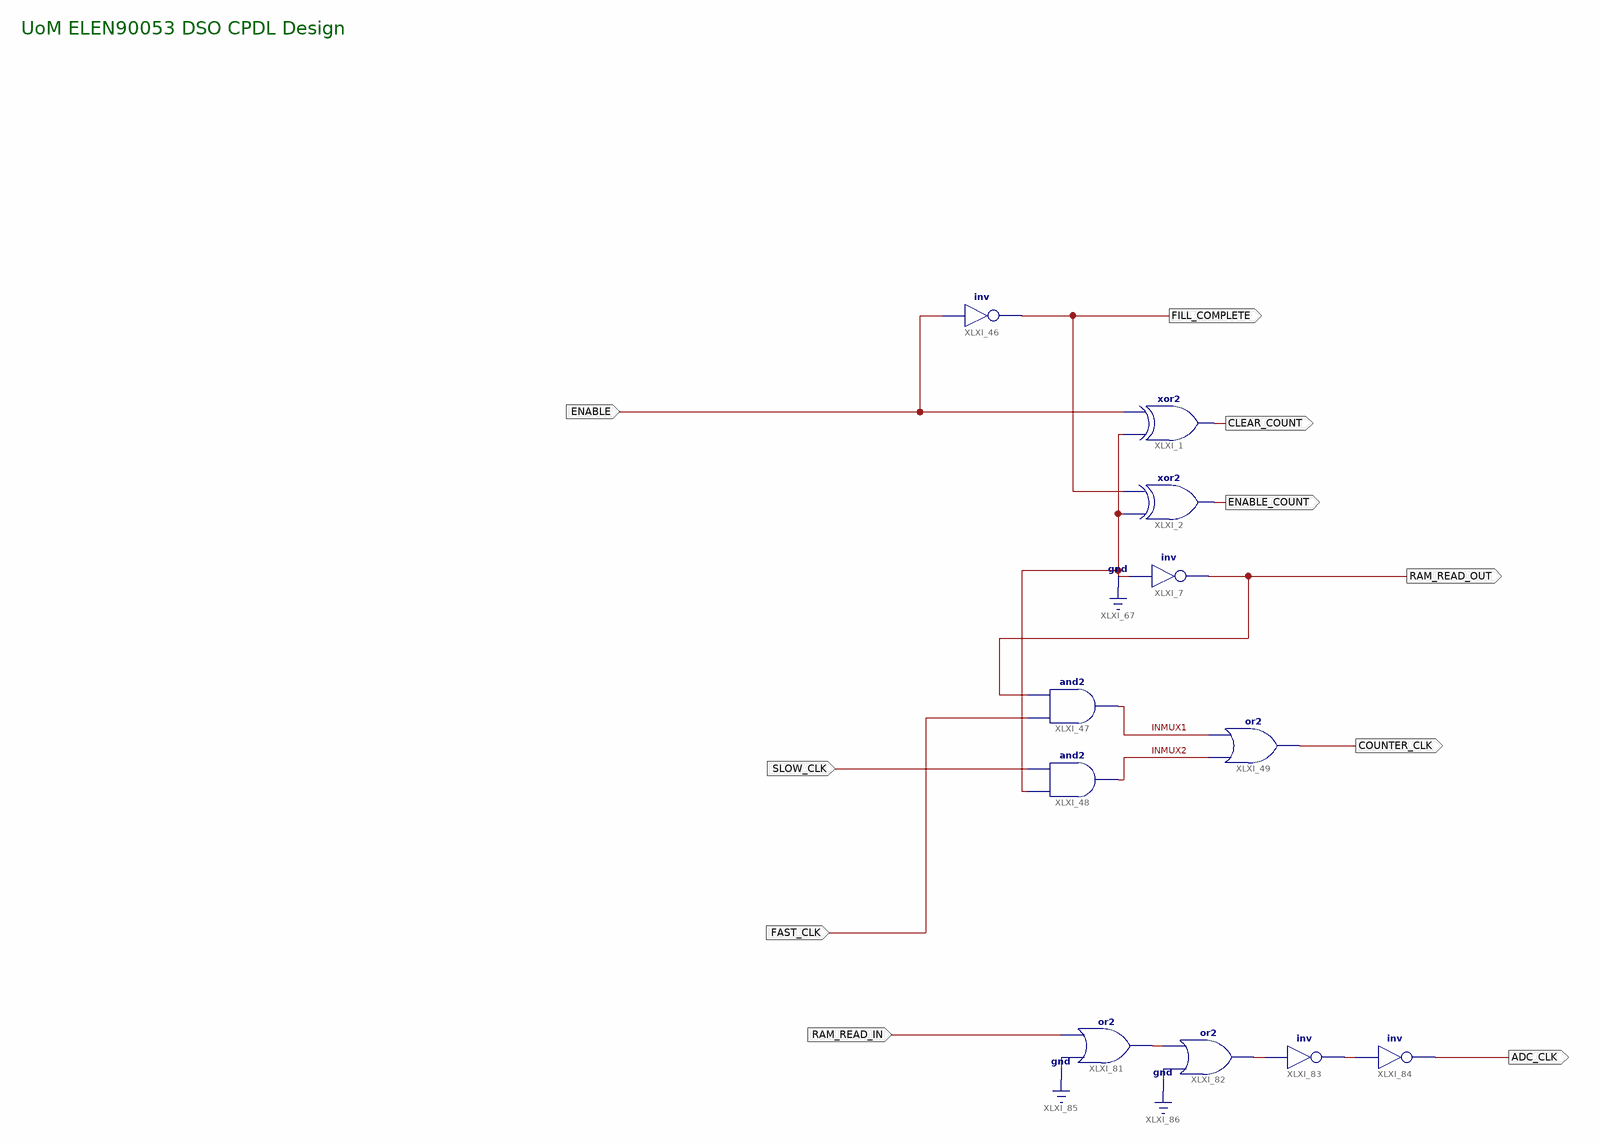
[diagram p0: schematic sheet 1]
// Xilinx ISE schematic CPLD_top.sch (xc9500xl) as structural Verilog: 11 symbols, 10 ports
module CPLD_top (
  input  SLOW_CLK,
  input  ENABLE,
  input  FAST_CLK,
  input  RAM_READ_IN,
  output RAM_READ_OUT,
  output CLEAR_COUNT,
  output ENABLE_COUNT,
  output FILL_COMPLETE,
  output COUNTER_CLK,
  output ADC_CLK
);

  wire INMUX1, INMUX2, XLXN_120, XLXN_121, XLXN_122;

  xor XLXI_1 (CLEAR_COUNT, 1'b0, ENABLE);
  xor XLXI_2 (ENABLE_COUNT, 1'b0, FILL_COMPLETE);
  not XLXI_7 (RAM_READ_OUT, 1'b0);
  not XLXI_46 (FILL_COMPLETE, ENABLE);
  and XLXI_47 (INMUX1, FAST_CLK, RAM_READ_OUT);
  and XLXI_48 (INMUX2, 1'b0, SLOW_CLK);
  or XLXI_49 (COUNTER_CLK, INMUX2, INMUX1);
  or XLXI_81 (XLXN_120, 1'b0, RAM_READ_IN);
  or XLXI_82 (XLXN_121, 1'b0, XLXN_120);
  not XLXI_83 (XLXN_122, XLXN_121);
  not XLXI_84 (ADC_CLK, XLXN_122);

  // Notes on the sheet:
  //   UoM ELEN90053 DSO CPDL Design
endmodule
